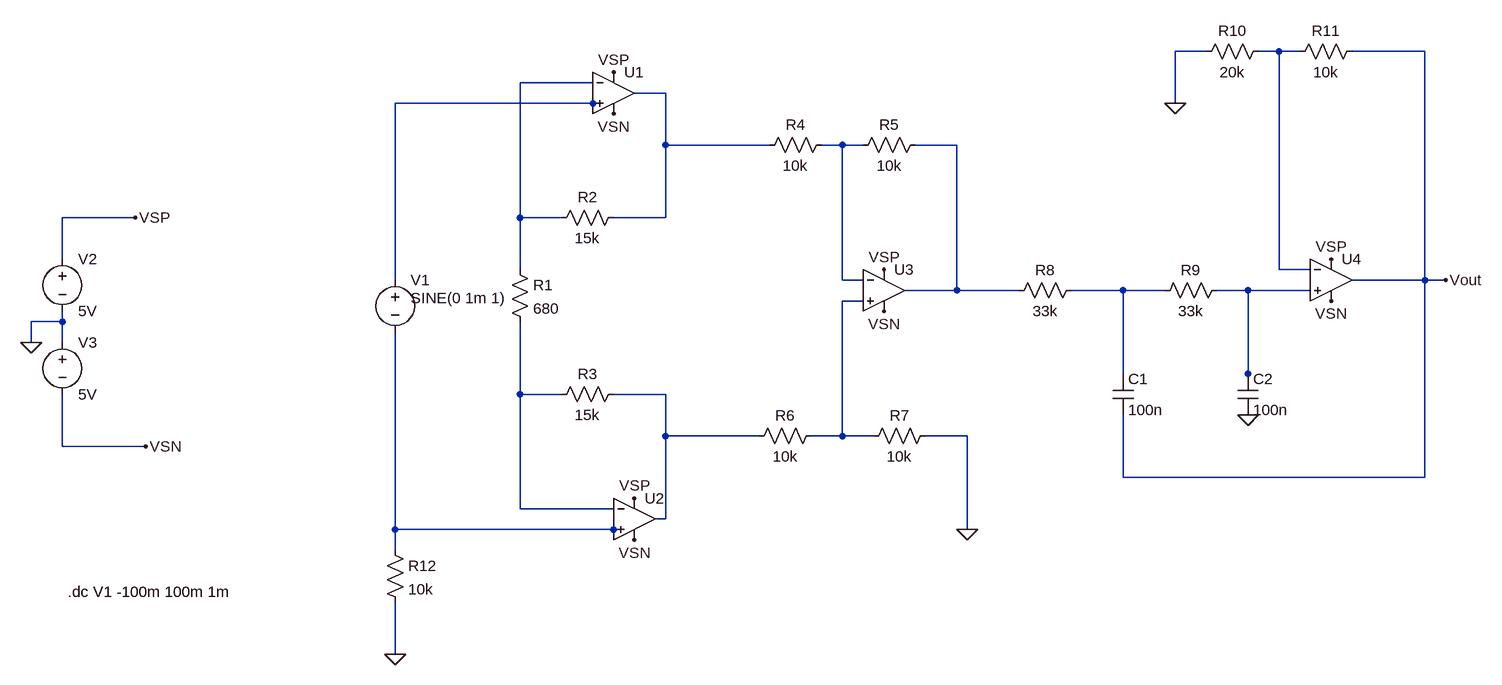
[diagram p0: schematic ex2.asc]
ex2.asc, the LTspice schematic file:
Version 4
SHEET 1 3044 920
WIRE 1792 -208 1744 -208
WIRE 1904 -208 1872 -208
WIRE 1936 -208 1904 -208
WIRE 2128 -208 2016 -208
WIRE 848 -160 736 -160
WIRE 960 -144 912 -144
WIRE 848 -128 544 -128
WIRE 864 -128 848 -128
WIRE 1744 -128 1744 -208
WIRE 960 -64 960 -144
WIRE 1120 -64 960 -64
WIRE 1232 -64 1200 -64
WIRE 1264 -64 1232 -64
WIRE 1408 -64 1344 -64
WIRE 144 48 32 48
WIRE 736 48 736 -160
WIRE 800 48 736 48
WIRE 960 48 960 -64
WIRE 960 48 880 48
WIRE 32 112 32 48
WIRE 736 128 736 48
WIRE 1904 128 1904 -208
WIRE 1952 128 1904 128
WIRE 544 144 544 -128
WIRE 1232 144 1232 -64
WIRE 1264 144 1232 144
WIRE 2128 144 2128 -208
WIRE 2128 144 2016 144
WIRE 2160 144 2128 144
WIRE 1408 160 1408 -64
WIRE 1408 160 1328 160
WIRE 1504 160 1408 160
WIRE 1664 160 1584 160
WIRE 1728 160 1664 160
WIRE 1856 160 1808 160
WIRE 1952 160 1856 160
WIRE 1264 176 1232 176
WIRE 32 208 32 192
WIRE 32 208 -16 208
WIRE -16 240 -16 208
WIRE 32 240 32 208
WIRE 1664 288 1664 160
WIRE 1856 288 1856 160
WIRE 1856 304 1856 288
WIRE 736 320 736 208
WIRE 800 320 736 320
WIRE 960 320 880 320
WIRE 960 384 960 320
WIRE 1104 384 960 384
WIRE 1232 384 1232 176
WIRE 1232 384 1184 384
WIRE 1280 384 1232 384
WIRE 1424 384 1360 384
WIRE 32 400 32 320
WIRE 160 400 32 400
WIRE 1664 448 1664 352
WIRE 2128 448 2128 144
WIRE 2128 448 1664 448
WIRE 736 496 736 320
WIRE 880 496 736 496
WIRE 960 512 960 384
WIRE 960 512 944 512
WIRE 544 528 544 224
WIRE 880 528 544 528
WIRE 896 528 880 528
WIRE 1424 528 1424 384
WIRE 544 560 544 528
WIRE 544 720 544 640
FLAG -16 240 0
FLAG 144 48 VSP
FLAG 160 400 VSN
FLAG 544 720 0
FLAG 912 480 VSP
FLAG 880 -176 VSP
FLAG 912 544 VSN
FLAG 1424 528 0
FLAG 1856 352 0
FLAG 1744 -128 0
FLAG 2160 144 Vout
FLAG 1296 128 VSP
FLAG 1296 192 VSN
FLAG 1984 176 VSN
FLAG 1984 112 VSP
FLAG 880 -112 VSN
SYMBOL voltage 32 96 R0
WINDOW 123 0 0 Left 0
WINDOW 39 0 0 Left 0
SYMATTR InstName V2
SYMATTR Value 5V
SYMBOL voltage 32 224 R0
WINDOW 123 0 0 Left 0
WINDOW 39 0 0 Left 0
SYMATTR InstName V3
SYMATTR Value 5V
SYMBOL voltage 544 128 R0
WINDOW 123 0 0 Left 0
WINDOW 39 0 0 Left 0
WINDOW 3 24 44 Left 2
SYMATTR Value SINE(0 1m 1)
SYMATTR InstName V1
SYMBOL res 528 544 R0
SYMATTR InstName R12
SYMATTR Value 10k
SYMBOL res 720 112 R0
SYMATTR InstName R1
SYMATTR Value 680
SYMBOL res 896 32 R90
WINDOW 0 0 56 VBottom 2
WINDOW 3 32 56 VTop 2
SYMATTR InstName R2
SYMATTR Value 15k
SYMBOL res 896 304 R90
WINDOW 0 0 56 VBottom 2
WINDOW 3 32 56 VTop 2
SYMATTR InstName R3
SYMATTR Value 15k
SYMBOL res 1216 -80 R90
WINDOW 0 0 56 VBottom 2
WINDOW 3 32 56 VTop 2
SYMATTR InstName R4
SYMATTR Value 10k
SYMBOL res 1360 -80 R90
WINDOW 0 0 56 VBottom 2
WINDOW 3 32 56 VTop 2
SYMATTR InstName R5
SYMATTR Value 10k
SYMBOL res 1200 368 R90
WINDOW 0 0 56 VBottom 2
WINDOW 3 32 56 VTop 2
SYMATTR InstName R6
SYMATTR Value 10k
SYMBOL res 1376 368 R90
WINDOW 0 0 56 VBottom 2
WINDOW 3 32 56 VTop 2
SYMATTR InstName R7
SYMATTR Value 10k
SYMBOL res 1600 144 R90
WINDOW 0 0 56 VBottom 2
WINDOW 3 32 56 VTop 2
SYMATTR InstName R8
SYMATTR Value 33k
SYMBOL res 1824 144 R90
WINDOW 0 0 56 VBottom 2
WINDOW 3 32 56 VTop 2
SYMATTR InstName R9
SYMATTR Value 33k
SYMBOL cap 1648 288 R0
SYMATTR InstName C1
SYMATTR Value 100n
SYMBOL cap 1840 288 R0
SYMATTR InstName C2
SYMATTR Value 100n
SYMBOL res 1888 -224 R90
WINDOW 0 0 56 VBottom 2
WINDOW 3 32 56 VTop 2
SYMATTR InstName R10
SYMATTR Value 20k
SYMBOL res 2032 -224 R90
WINDOW 0 0 56 VBottom 2
WINDOW 3 32 56 VTop 2
SYMATTR InstName R11
SYMATTR Value 10k
SYMBOL OpAmps\\UniversalOpAmp2 880 -144 R0
SYMATTR InstName U1
SYMBOL OpAmps\\UniversalOpAmp2 912 512 R0
SYMATTR InstName U2
SYMBOL OpAmps\\UniversalOpAmp2 1296 160 R0
SYMATTR InstName U3
SYMBOL OpAmps\\UniversalOpAmp2 1984 144 R0
SYMATTR InstName U4
TEXT 40 624 Left 2 !.dc V1 -100m 100m 1m

The netlist it stands for:
* ex2.asc
V2 VSP 0 5V
V3 0 VSN 5V
V1 N004 N012 SINE(0 1m 1)
R12 N012 0 10k
R1 N002 N010 680
R2 N003 N002 15k
R3 N011 N010 15k
R4 N005 N003 10k
R5 N006 N005 10k
R6 N009 N011 10k
R7 0 N009 10k
R8 N007 N006 33k
R9 N008 N007 33k
C1 N007 Vout 100n
C2 N008 0 100n
R10 N001 0 20k
R11 Vout N001 10k
XU1 N004 N002 VSP VSN N003 level2 Avol=1Meg GBW=10Meg Slew=10Meg Ilimit=25m Rail=0 Vos=0 En=0 Enk=0 In=0 Ink=0 Rin=500Meg  ; pins In+ In- V+ V- OUT
XU2 N012 N010 VSP VSN N011 level2 Avol=1Meg GBW=10Meg Slew=10Meg Ilimit=25m Rail=0 Vos=0 En=0 Enk=0 In=0 Ink=0 Rin=500Meg  ; pins In+ In- V+ V- OUT
XU3 N009 N005 VSP VSN N006 level2 Avol=1Meg GBW=10Meg Slew=10Meg Ilimit=25m Rail=0 Vos=0 En=0 Enk=0 In=0 Ink=0 Rin=500Meg  ; pins In+ In- V+ V- OUT
XU4 N008 N001 VSP VSN Vout level2 Avol=1Meg GBW=10Meg Slew=10Meg Ilimit=25m Rail=0 Vos=0 En=0 Enk=0 In=0 Ink=0 Rin=500Meg  ; pins In+ In- V+ V- OUT
.dc V1 -100m 100m 1m
.lib UniversalOpAmp2.lib
.backanno
.end